# Altium schematic sheet 延时测试器.SchDoc
size 508 x 508 mm; SheetNumber: 1; SheetTotal: 1
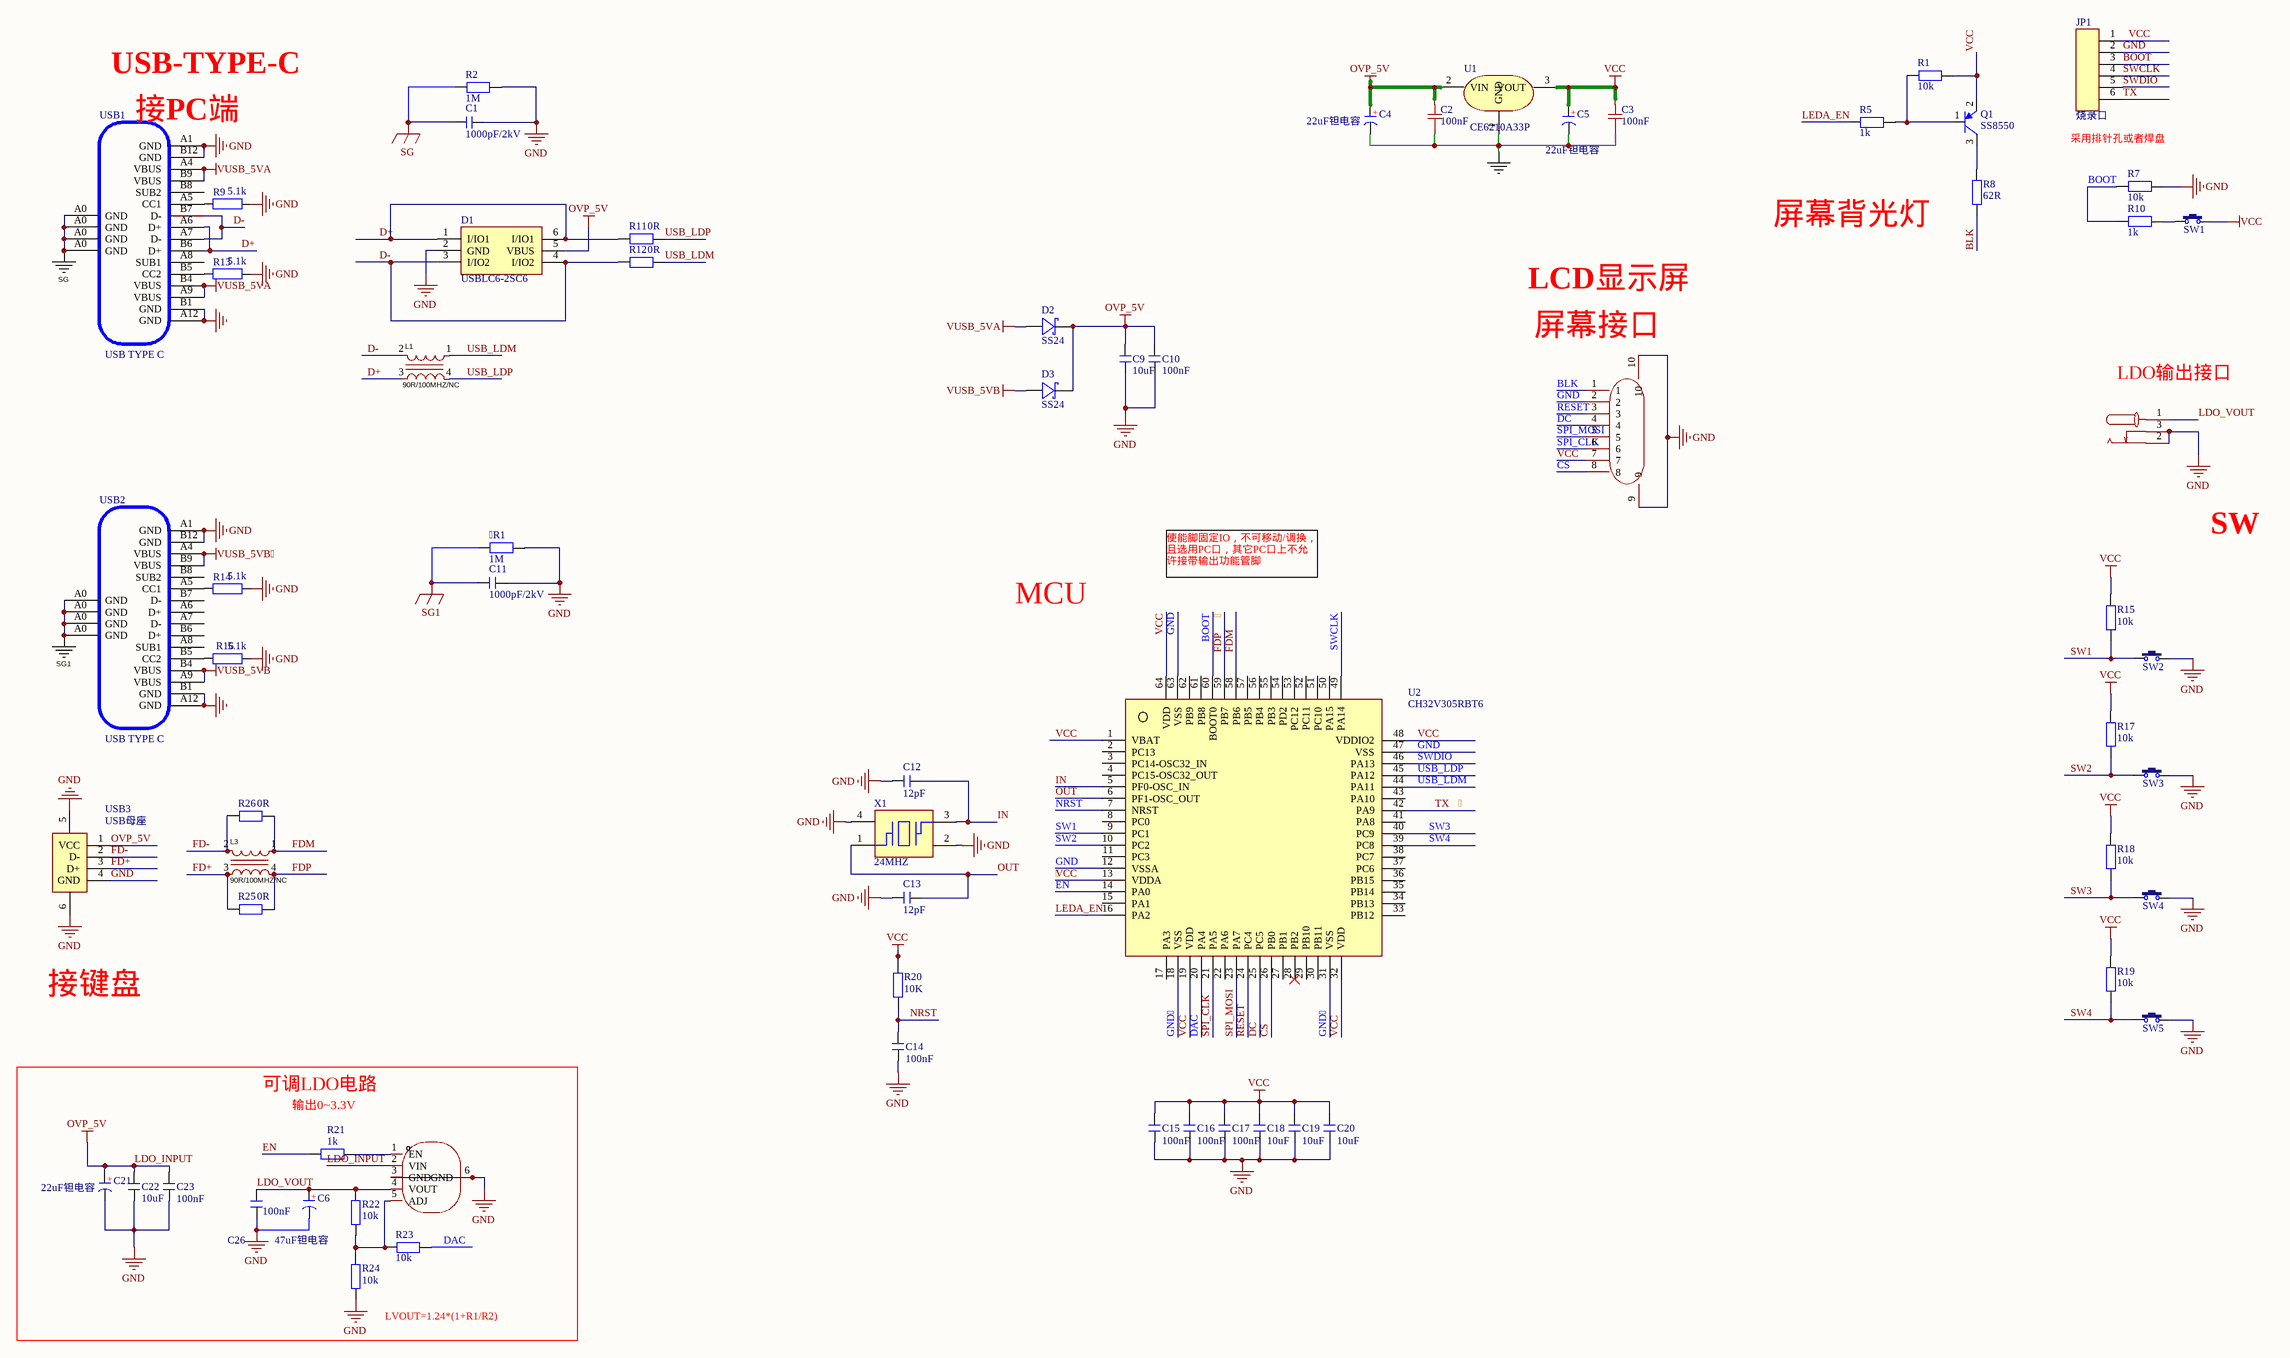
[diagram p0: 延时测试器.SchDoc]

## Parts
R1  1M  [R 1206_L]
C1  1000pF/2kV  [C 1206_L]
C2  100nF  [C 0603_L]
C3  100nF  [C 0603_L]
C4  22uF钽电容  [CD B(3528)]
C5  22uF钽电容  [CD B(3528)]
C6  47uF钽电容  [CD B(3528)]
C9  10uF  [C 0603_L]
C10  100nF  [C 0603_L]
C11  1000pF/2kV  [C 1206_L]
C12  12pF  [C 0603_L]
C13  12pF  [C 0603_L]
C14  100nF  [C 0603_L]
C15  100nF  [C 0603_L]
C16  100nF  [C 0603_L]
C17  100nF  [C 0603_L]
C18  10uF  [C 0603_L]
C19  10uF  [C 0603_L]
C20  10uF  [C 0603_L]
C21  22uF钽电容  [CD B(3528)]
C22  10uF  [C 0603_L]
C23  100nF  [C 0603_L]
C26  100nF  [C 0603_L]
D1  USBLC6-2SC6  [SOT23-6M]
D2  SS24  [SMA]
D3  SS24  [SMA]
DC1  DC-002-2.0A-1.3  [DC-IN-TH_DC-002-2.0A-1.3]  (value not drawn)
FPC1  屏幕接口  [FPC-SMD_AFC07-S08FCA-00]  (value not drawn)
JP1  烧录口  [烧录口]
L1  90R/100MHZ/NC  [2012-L]
L3  90R/100MHZ/NC  [2012-L]
Q1  SS8550  [SOT23L]
R1  10k  [R 0603_L]
R2  1M  [R 1206_L]
R5  1k  [R 0603_L]
R7  10k  [R 0603_L]
R8  62R  [R 0603_L]
R9  5.1k  [R 0603_L]
R10  1k  [R 0603_L]
R11  0R  [R 0603_L]
R12  0R  [R 0603_L]
R13  5.1k  [R 0603_L]
R14  5.1k  [R 0603_L]
R15  10k  [R 0603_L]
R16  5.1k  [R 0603_L]
R17  10k  [R 0603_L]
R18  10k  [R 0603_L]
R19  10k  [R 0603_L]
R20  10K  [R 0603_L]
R21  1k  [R 0603_L]
R22  10k  [R 0603_L]
R23  10k  [R 0603_L]
R24  10k  [R 0603_L]
R25  0R  [R 0603_L]
R26  0R  [R 0603_L]
SW1  3x6x5  [SW-SMD_L6.0-W3.3-LS8.0]  (value not drawn)
SW2  3x6x5  [SW-TH_4P-L7.4-W5.0-P5.0]  (value not drawn)
SW3  3x6x5  [SW-TH_4P-L7.4-W5.0-P5.0]  (value not drawn)
SW4  3x6x5  [SW-TH_4P-L7.4-W5.0-P5.0]  (value not drawn)
SW5  3x6x5  [SW-TH_4P-L7.4-W5.0-P5.0]  (value not drawn)
U1  CE6210A33P  [SOT89-3]
U2  CH32V305RBT6  [LQFP64 10x10_M]
U3  D2652-AD  [TO-263-5_L10.2-W8.9-P1.70-TL-LS15.2]  (value not drawn)
USB1  USB TYPE C  [TYPE-C 16PIN 2MD(073)]
USB2  USB TYPE C  [TYPE-C 16PIN 2MD(073)]
USB3  USB母座  [USB-A/S_B]
X1  24MHZ  [OSC 3225-4P]

## Blocks framed on the sheet
可调LDO电路: C6 C21-C23 C26 R21-R24 U3

## Nets
: C3.2 C5.1(A) C15.2 C16.2 C17.2 C18.2 C19.2 C20.2 FPC1.7 JP1.1 JP1.6 L3.4 Q1.2(E) R1.1 R15.2 R17.2 R18.2 R19.2 R20.2 R25.1 SW1.4 U1.3(VOUT) U2.1(VBAT) U2.13(VDDA) U2.19(VDD) U2.32(VDD) U2.42(PA9) U2.48(VDDIO2) U2.59(PB7) U2.64(VDD)  [also labelled FDP, TX, VCC]
GND: R1.2 C1.1 C2.1 C3.1 C4.2(K) C5.2(K) C6.2(K) C9.1 C10.1 C11.1 C12.1 C13.1 C14.1 C15.1 C16.1 C17.1 C18.1 C19.1 C20.1 C21.2(K) C22.1 C23.1 C26.1 D1.2(GND) DC1.2 DC1.3 FPC1.2 FPC1.9 FPC1.10 JP1.2 R2.2 R7.1 R9.1 R13.1 R14.1 R16.1 R24.2 SW2.4 SW3.4 SW4.4 SW5.4 U1.1(GND) U2.12(VSSA) U2.47(VSS) U2.63(VSS) U3.3(GND) U3.6(GND) USB1.A1(GND) USB1.A12(GND) USB1.B1(GND) USB1.B12(GND) USB2.A1(GND) USB2.A12(GND) USB2.B1(GND) USB2.B12(GND) USB3.4(GND) USB3.5(GND) USB3.6(GND) X1.2(GND) X1.4(GND)
LDO_INPUT: C2.2 C4.1(A) C9.2 C10.2 C21.1(A) C22.2 C23.2 D1.5(VBUS) D2.2 D3.2 U1.2(VIN) U3.2(VIN) USB3.1(VCC)  [also labelled OVP_5V]
SG: C1.2 R2.1 USB1.A0(GND)
SG1: R1.1 C11.2 USB2.A0(GND)
VUSB_5VA: D2.1 USB1.A4(VBUS) USB1.A9(VBUS) USB1.B4(VBUS) USB1.B9(VBUS)
VUSB_5VB: D3.1 USB2.A9(VBUS) USB2.B4(VBUS)
VUSB_5VB: USB2.A4(VBUS) USB2.B9(VBUS)
BLK: FPC1.1 R8.2
BOOT: JP1.3 R7.2 R10.2 U2.60(BOOT0)
CS: FPC1.8 U2.26(PB0)
D+: D1.1(I/IO1) D1.6(I/IO1) L1.3 R11.2 USB1.A6(D+) USB1.B6(D+)
D-: D1.3(I/IO2) D1.4(I/IO2) L1.2 R12.2 USB1.A7(D-) USB1.B7(D-)
DAC: R23.2 U2.20(PA4)
DC: FPC1.4 U2.25(PC5)
EN: R21.2 U2.14(PA0)
FD+: L3.3 R25.2 USB3.3(D+)
FD-: L3.2 R26.2 USB3.2(D-)
FDM: L3.1 R26.1 U2.58(PB6)
GND: U2.18(VSS) U2.31(VSS)
IN: C12.2 U2.5(PF0-OSC_IN) X1.3(OSC2)
LDO_VOUT: C6.1(A) C26.2 DC1.1 R22.1 U3.4(VOUT)
LEDA_EN: R5.2 U2.16(PA2)
NRST: C14.2 R20.1 U2.7(NRST)
OUT: C13.2 U2.6(PF1-OSC_OUT) X1.1(OSC1)
RESET: FPC1.3 U2.24(PC4)
SPI_CLK: FPC1.6 U2.21(PA5)
SPI_MOSI: FPC1.5 U2.23(PA7)
SW1: R15.1 SW2.1 U2.9(PC1)
SW2: R17.1 SW3.1 U2.10(PC2)
SW3: R18.1 SW4.1 U2.40(PC9)
SW4: R19.1 SW5.1 U2.39(PC8)
SWCLK: JP1.4 U2.49(PA14)
SWDIO: JP1.5 U2.46(PA13)
USB_LDM: L1.1 R12.1 U2.44(PA11)
USB_LDP: L1.4 R11.1 U2.45(PA12)
NetQ1_1: Q1.1(B) R1.2 R5.1
NetQ1_3: Q1.3(C) R8.1
NetR9_2: R9.2 USB1.A5(CC1)
NetR10_1: R10.1 SW1.1
NetR13_2: R13.2 USB1.B5(CC2)
NetR14_2: R14.2 USB2.A5(CC1)
NetR16_2: R16.2 USB2.B5(CC2)
NetR21_1: R21.1 U3.1(EN)
NetR22_2: R22.2 R23.1 R24.1 U3.5(ADJ)

Not connected (* = marked no-connect by the designer): U2 2(PC13) 3(PC14-OSC32_IN) 4(PC15-OSC32_OUT) 8(PC0) 11(PC3) 15(PA1) 17(PA3) 22(PA6) 27(PB1) 28(PB2)* 29(PB10) 30(PB11) 33(PB12) 34(PB13) 35(PB14) 36(PB15) 37(PC6) 38(PC7) 41(PA8) 43(PA10) 50(PA15) 51(PC10) 52(PC11) 53(PC12) 54(PD2) 55(PB3) 56(PB4) 57(PB5) 61(PB8) 62(PB9); USB1 A8(SUB1) B8(SUB2); USB2 A6(D+) A7(D-) A8(SUB1) B6(D+) B7(D-) B8(SUB2)

## Notes on the sheet
- USB-TYPE-C
- (near USB1) 接PC端
- 采用排针孔或者焊盘
- 屏幕背光灯
- LCD显示屏
- (near FPC1) 屏幕接口
- (near DC1) LDO输出接口
- 使能脚固定IO，不可移动/调换，且选用PC口，其它PC口上不允许接带输出功能管脚
- SW
- MCU
- 接键盘
- (near R21) 输出0~3.3V
- (near R24) LVOUT=1.24*(1+R1/R2)
- (in symbol C-CD) +

## Library data of the parts
R1 R1 R2 R5 R7 R8 R10-R12 R15 R17-R26 = R: 贴片电阻
C1 C9-C20 C23 C26 = C: 无极性贴片电容
C2 C3 = CC0603KRX7R9BB104: 容值:100nF;精度:±10%;额定电压:50V;材质(温度系数):X7R;; Manufacturer: YAGEO(国巨); Symbol: capacitance; Add into BOM: yes; Tolerance: ±10%; Voltage Rated: 50V; Temperature Coefficient: X7R; Device: CC0603KRX7R9BB104; LCSC Part Name: 100nF ±10% 50V; Supplier Part: C14663; Manufacturer Part: CC0603KRX7R9BB104; Supplier Footprint: 0603; JLCPCB Part Class: Basic Part; Datasheet: https://atta.szlcsc.com/upload/public/pdf/source/20180910/C282072_33301C7F631E79921B82A8DAC6BCC5B3.pdf; Supplier: LCSC; Convert to PCB: yes; Value: 100nF
C4-C6 C21 = C-CD: 贴片钽电容
C22 = C_2: 无极性贴片电容
D1 = USBLC6-2SC6: TVS/ESD
D2 D3 = 1N5819WS: 肖特基二极管
DC1 = DC-002-2.0A-1.3: Manufacturer: XKB Connection(中国星坤); Add into BOM: yes; Connector Type: DC电源插座; Inside Contact Diameter: 1.3mm; Outside Contact Diameter: 4.2mm; Current Rating: 2A; Voltage Rating (Max): 24V; Symbol: DC-002-2.0A-1.3; Device: DC-002-2.0A-1.3; LCSC Part Name: DC电源插座 内径:1.3mm 外径:4.2mm; Supplier Part: C381119; Manufacturer Part: DC-002-2.0A-1.3; Supplier Footprint: 插件; JLCPCB Part Class: Extended Part; Datasheet: https://item.szlcsc.com/datasheet/DC-002-2.0A-1.3/353351.html; Supplier: LCSC; Convert to PCB: yes; Mounting Type: 弯插; Operating Temperature: -20℃~+70℃
FPC1 = AFA07-S08FCA-00: Manufacturer: JS(钜硕电子); Add into BOM: yes; Locking Feature: 抽屉式; Number of Contacts: 8P; Pitch: 1mm; FFC, FCB Thickness: 0.3mm; Symbol: AFA07-S08FCA-00; Device: AFA07-S08FCA-00; LCSC Part Name: 间距:1mm P数:8P 抽屉式 下接; Supplier Part: C262714; Manufacturer Part: AFA07-S08FCA-00; Supplier Footprint: SMD,P=1mm,卧贴; JLCPCB Part Class: Extended Part; Datasheet: https://atta.szlcsc.com/upload/public/pdf/source/20191217/C262716_30B15E9A77BFCA4A54741C92DB3BE8CC.pdf; Supplier: LCSC; Convert to PCB: yes; Contact Type: 下接; Mounting Type: 卧贴; Height Above Board: 2.5mm
L1 L3 = YLM2012-900T: Manufacturer: YJYCOIN(益嘉源); Add into BOM: yes; Number of Lines: 2; Current Rating: 400mA; Voltage Rating - DC: 50V; Impedance @ Frequency: 90Ω@100MHz; DC Resistance (DCR): 300mΩ; Symbol: YLM2012-900T; Device: YLM2012-900T; LCSC Part Name: 两路 贴片共模滤波器 阻抗90Ω@100MHz; Supplier Part: C917646; Manufacturer Part: YLM2012-900T; Supplier Footprint: SMD,2x1.2x1.2mm; JLCPCB Part Class: Extended Part; Datasheet: https://atta.szlcsc.com/upload/public/pdf/source/20201116/C917646_392008C7B4F7EEB978DDFC288C44F8F3.pdf; Supplier: LCSC; Convert to PCB: yes; Operating Temperature: -40℃~+125℃
Q1 = 8550-SMD: 高频放大-PNP型; 版权归属: 源创客; 属性: 40V 1.5A 1W 100MHZ; BOM名称: 高频放大-PNP型; 学习资源: www.ooocke.com
R9 R13 R14 R16 = Res: 贴片电阻(Res)
SW1-SW5 = TSW 3x6: 3x6轻触开关; 版权归属: 源创客; BOM名称: 3x6轻触开关; 学习资源: www.ooocke.com
U1 = CE6200A33P: Add into BOM: yes; Check: false; Symbol: CE6200A33P; Device: CE6200A33P; Convert to PCB: yes
U2 = CH32V305RBT6: 微控制器/MCU
U3 = D2652-AD: Manufacturer: Silicore(芯谷); Add into BOM: yes; Output Type: 可调; Voltage - Supply: 26V; Output Voltage: 1.24V~15V; Output Current: 5A; Voltage Dropout: 560mV@(5A); standby current: 15mA; Noise: 400uVrms; Output Configuration: 正极; Symbol: D2652-AD; Device: D2652-AD; LCSC Part Name: D2652-AD; Supplier Part: C2837289; Manufacturer Part: D2652-AD; Supplier Footprint: TO-263-5; Datasheet: https://atta.szlcsc.com/upload/public/pdf/source/20240301/4921E6B6D5A71F2B3F735310CA9A4D4F.pdf; Supplier: LCSC; Convert to PCB: yes; Features: 过流保护；反接保护；带使能；过热保护; Operating Temperature: -40℃~+125℃@(Tj)
USB1 USB2 = TYPE-C-16: USB连接器(Type-C)
USB3 = USB-A/S: USB-A型母接口; 版权归属: 源创客; BOM名称: USB-A型母接口; 学习资源: www.ooocke.com
X1 = 24MHZ: 晶振/24Mhz